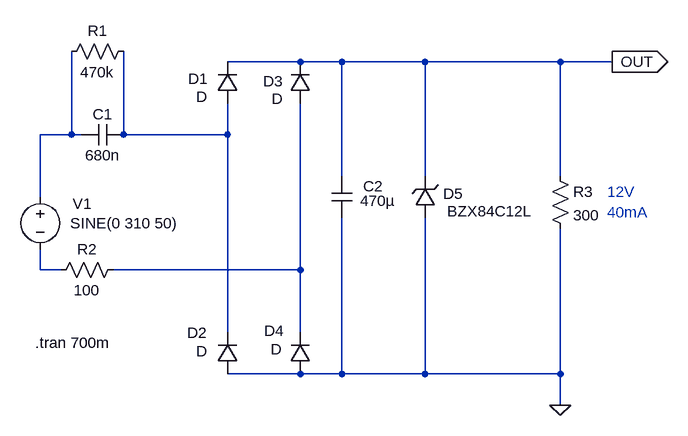
[diagram p0: schematic v1.0.asc]
v1.0.asc, the LTspice schematic file:
Version 4.1
SHEET 1 1212 680
WIRE 576 -48 464 -48
WIRE 640 -48 576 -48
WIRE 768 -48 640 -48
WIRE 976 -48 768 -48
WIRE 1056 -48 976 -48
WIRE 224 64 224 -64
WIRE 224 64 176 64
WIRE 240 64 224 64
WIRE 304 64 304 -64
WIRE 464 64 464 16
WIRE 464 64 304 64
WIRE 640 128 640 -48
WIRE 768 128 768 -48
WIRE 976 128 976 -48
WIRE 176 160 176 64
WIRE 176 272 176 240
WIRE 208 272 176 272
WIRE 576 272 576 16
WIRE 576 272 288 272
WIRE 464 368 464 64
WIRE 576 368 576 272
WIRE 576 432 464 432
WIRE 640 432 640 192
WIRE 640 432 576 432
WIRE 768 432 768 192
WIRE 768 432 640 432
WIRE 976 432 976 208
WIRE 976 432 768 432
WIRE 976 480 976 432
FLAG 976 480 0
FLAG 1056 -48 OUT
IOPIN 1056 -48 Out
SYMBOL voltage 176 144 R0
WINDOW 0 50 26 Left 2
WINDOW 3 46 56 Left 2
WINDOW 123 0 0 Left 0
WINDOW 39 0 0 Left 0
SYMATTR InstName V1
SYMATTR Value SINE(0 310 50)
SYMBOL cap 304 48 R90
WINDOW 0 0 32 VBottom 2
WINDOW 3 32 32 VTop 2
SYMATTR InstName C1
SYMATTR Value 680n
SYMBOL res 320 -80 R90
WINDOW 0 0 56 VBottom 2
WINDOW 3 32 56 VTop 2
SYMATTR InstName R1
SYMATTR Value 470k
SYMBOL diode 480 16 R180
WINDOW 0 46 38 Left 2
WINDOW 3 47 10 Left 2
SYMATTR InstName D1
SYMBOL diode 480 432 R180
WINDOW 0 47 63 Left 2
WINDOW 3 47 35 Left 2
SYMATTR InstName D2
SYMBOL diode 592 16 R180
WINDOW 0 42 34 Left 2
WINDOW 3 43 7 Left 2
SYMATTR InstName D3
SYMBOL diode 592 432 R180
WINDOW 0 41 66 Left 2
WINDOW 3 44 38 Left 2
SYMATTR InstName D4
SYMBOL res 304 256 R90
WINDOW 0 0 56 VBottom 2
WINDOW 3 32 56 VTop 2
SYMATTR InstName R2
SYMATTR Value 100
SYMBOL cap 624 128 R0
WINDOW 0 49 15 Left 2
WINDOW 3 44 38 Left 2
SYMATTR InstName C2
SYMATTR Value 470µ
SYMBOL zener 784 192 R180
WINDOW 0 -43 37 Left 2
WINDOW 3 -149 10 Left 2
SYMATTR InstName D5
SYMATTR Value BZX84C12L
SYMBOL res 960 112 R0
SYMATTR InstName R3
SYMATTR Value 300
TEXT 168 384 Left 2 !.tran 700m
TEXT 1048 152 Left 2 ;12V\n40mA

The netlist it stands for:
* v1.0.asc
V1 N001 N003 SINE(0 310 50)
C1 N002 N001 680n
R1 N002 N001 470k
D1 N002 OUT D
D2 0 N002 D
D3 N004 OUT D
D4 0 N004 D
R2 N004 N003 100
C2 OUT 0 470µ
D5 0 OUT BZX84C12L
R3 OUT 0 300
.model D D
.lib standard.dio
.tran 700m
* 12V
* 40mA
.backanno
.end